# EAGLE design node_vibration (EAGLE 6.6.0)
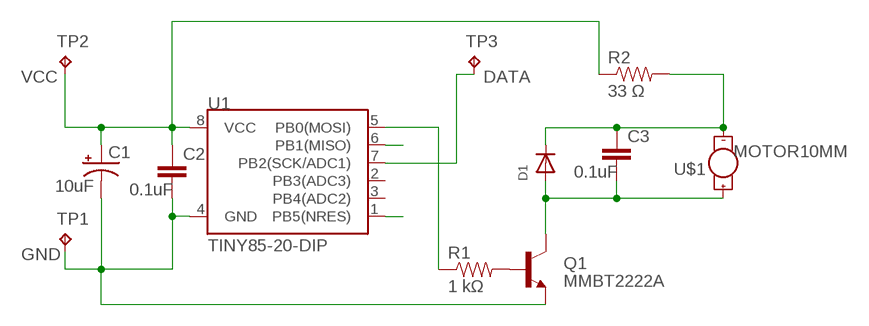
[diagram p0: schematic, sheet 1]

## Parts
C1  10uF  10UF-16V-10%(TANT)  [EIA3216]
C2  0.1uF  CAP1206  [1206]
C3  0.1uF  CAP1206  [1206]
D1  DIODESMA  [SMADIODE]
Q1  MMBT2222A  TRANSISTOR_NPNMMBT2222A  [SOT23-3]
R1  1 kΩ  RESISTOR1206  [1206]
R2  33 Ω  RESISTOR1206  [1206]
TP1  PADSTP13R  [CIRCLE-PAD-1/4]
TP2  PADSTP13R  [CIRCLE-PAD-1/4]
TP3  PADSTP13R  [CIRCLE-PAD-1/4]
U1  TINY85-20-DIP  ATTINY45TINY45-20-DIP  [DIP08]
U$1  MOTOR10MM  [VIBE-MOTOR-10MM]

## Nets
GND: C1.C(-) C2.2 Q1.2(E) TP1.TP U1.4(GND)
MISO-6: U1.6(PB1(MISO))
MOSI-5: R1.1 U1.5(PB0(MOSI))
N$1: Q1.1(B) R1.2
N$2: C3.1 D1.C R2.2 U$1.-
N$3: C3.2 D1.A Q1.3(C) U$1.+
RST: U1.1(PB5(NRES))
SCK-7: TP3.TP U1.7(PB2(SCK/ADC1))
VCC: C1.A(+) C2.1 R2.1 TP2.TP U1.8(VCC)
Unconnected: U1.2(PB3(ADC3)) U1.3(PB4(ADC2))

## Library data of the parts
C1 = SparkFun-Capacitors:10UF-16V-10%(TANT): CAP-00811 1206/EIA-3216 Tantalum capacitor; PROD_ID: CAP-00811
C2 C3 = SparkFun-Capacitors:CAP: Capacitor Standard 0603 ceramic capacitor, and 0.1" leaded capacitor.
D1 = adafruit:DIODE: Diode SMADIODE - SMA Surface Mount Package 20V 1A Schottky Diode Digikey: 641-1014-6-ND DO-1N4148 - Through Hole Small Current Diode SOD-123 20V 1 A (.5mV Vf) Schottky Diode - Digikey: MBRX120TPMSCT-ND SOD-323 10V 570mA (.38mV Vf, 3ns) Schottky Diode - Digikey: ZLLS410CT-ND SOD-523 30V 30mA Schottky Diode (RB751S-40TE61) - Digikey: RB751S-40TE61CT-ND SOT23-R/W - SOT23 Package (R = Solder Paste/Reflow Ovens, W = Hand-Soldering) BAT54Film 40V 300mA - Digikey: 497-7162-1-ND
Q1 = SparkFun-DiscreteSemi:TRANSISTOR_NPN: Generic NPN BJT MMBT2222A - TRANS-08049 (SOT-23, 1A 40V) MPSA42 - TRANS-09116 (SOT-23, 500mA 300V) MMBT5088LT1G - TRANS-11160 (SOT-23, 50 mA 30V) BC547 - COM-08928 <http://www.sparkfun.com/products/8928> (TO-92 45V 100mA) (1.Collector 2.Base 3.Emitter) 2N3904 - COM-00521 <http://www.sparkfun.com/products/521> (TO-92 40V 200mA) (1.Emitter 2.Base 3.Collector) P2N2222A - COM-12852 <http://www.sparkfun.com/products/12852> (TO-92 40V 600mA) (1.Collector 2.Base 3.Emitter); PROD_ID: TRANS-08049
R1 R2 = SparkFun-Passives:RESISTOR: Resistor Basic schematic elements and footprints for 0603, 1206, and PTH resistors.
TP1 = swamy-library:PADS: Pads; TP_SIGNAL_NAME: GND
TP2 = swamy-library:PADS: Pads; TP_SIGNAL_NAME: VCC
TP3 = swamy-library:PADS: Pads; TP_SIGNAL_NAME: DATA
U1 = SparkFun-DigitalIC:ATTINY45: Atmel 8-pin 2/4/8kB flash uC; PROD_ID: IC-09439; VALUE: TINY45-20-DIP
U$1 = swamy-library:MOTOR: Vibration Motor- ROB-08449 Physical dimension and wire connections for this powerful vibration motor. Motor has a self adhesive backing.

## Board
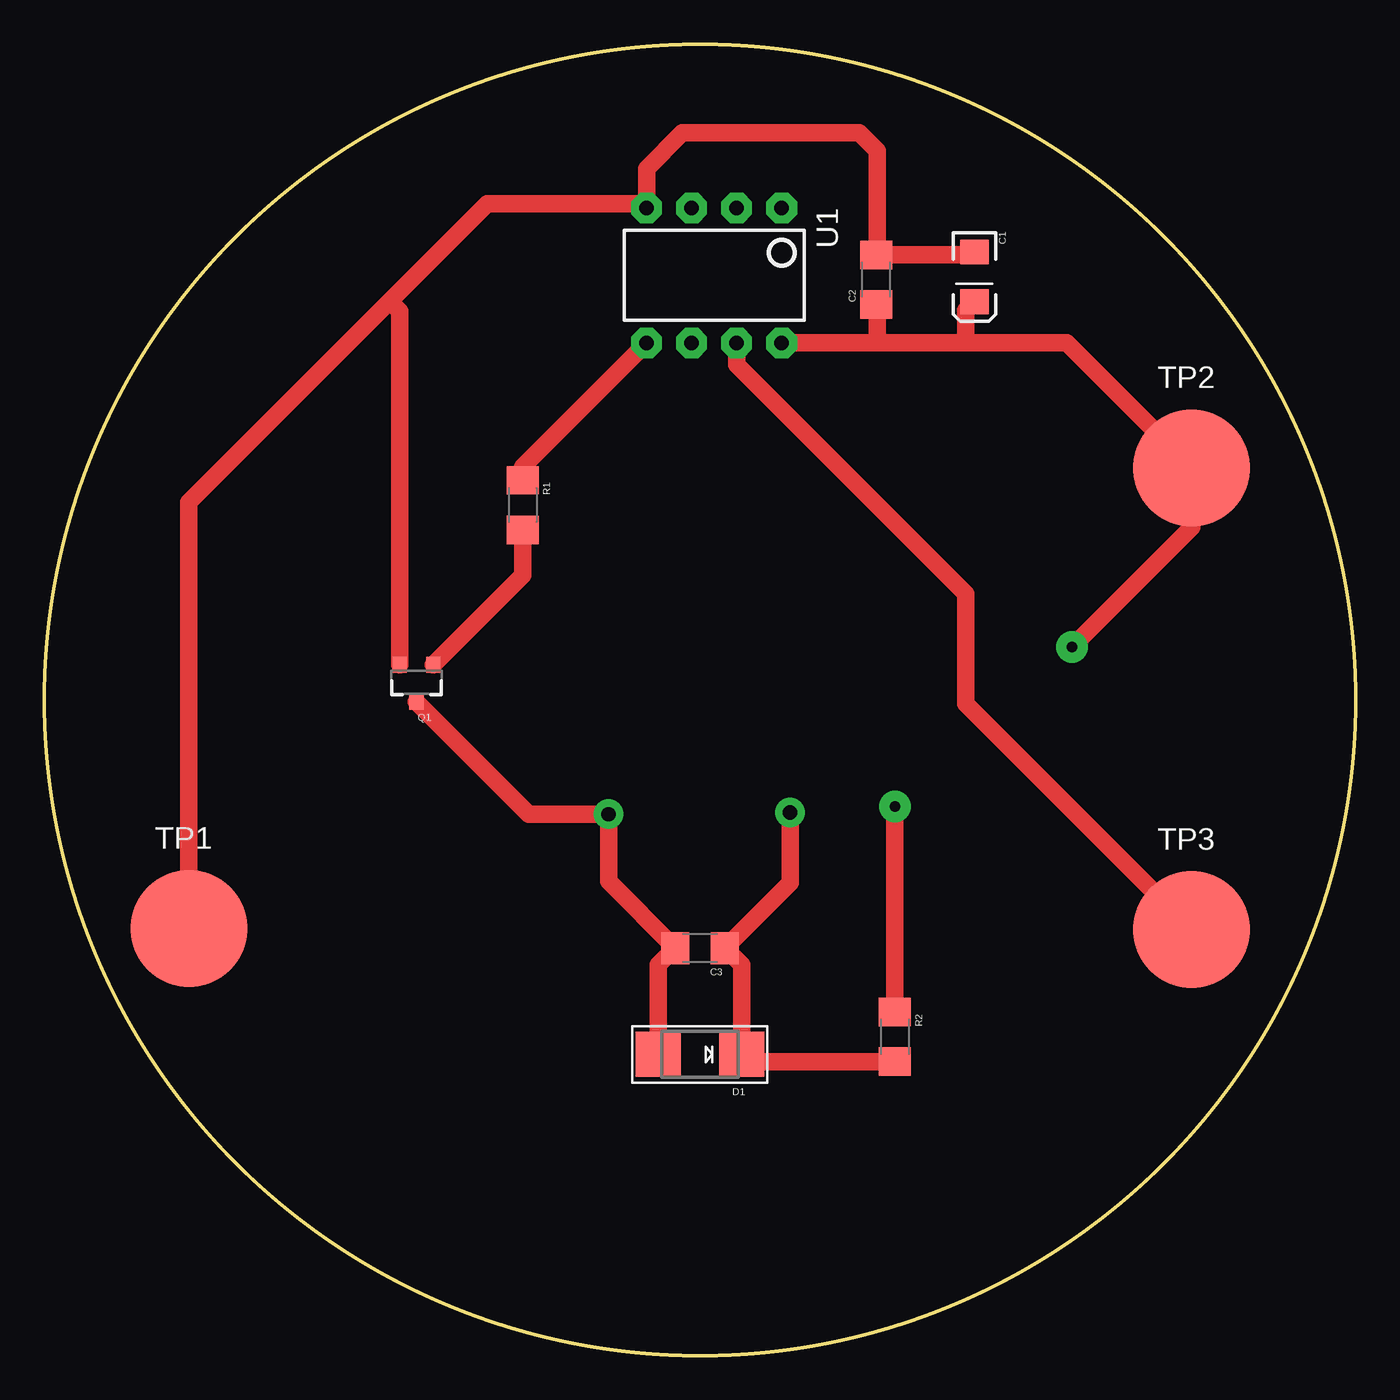
[diagram p1: board, top side]
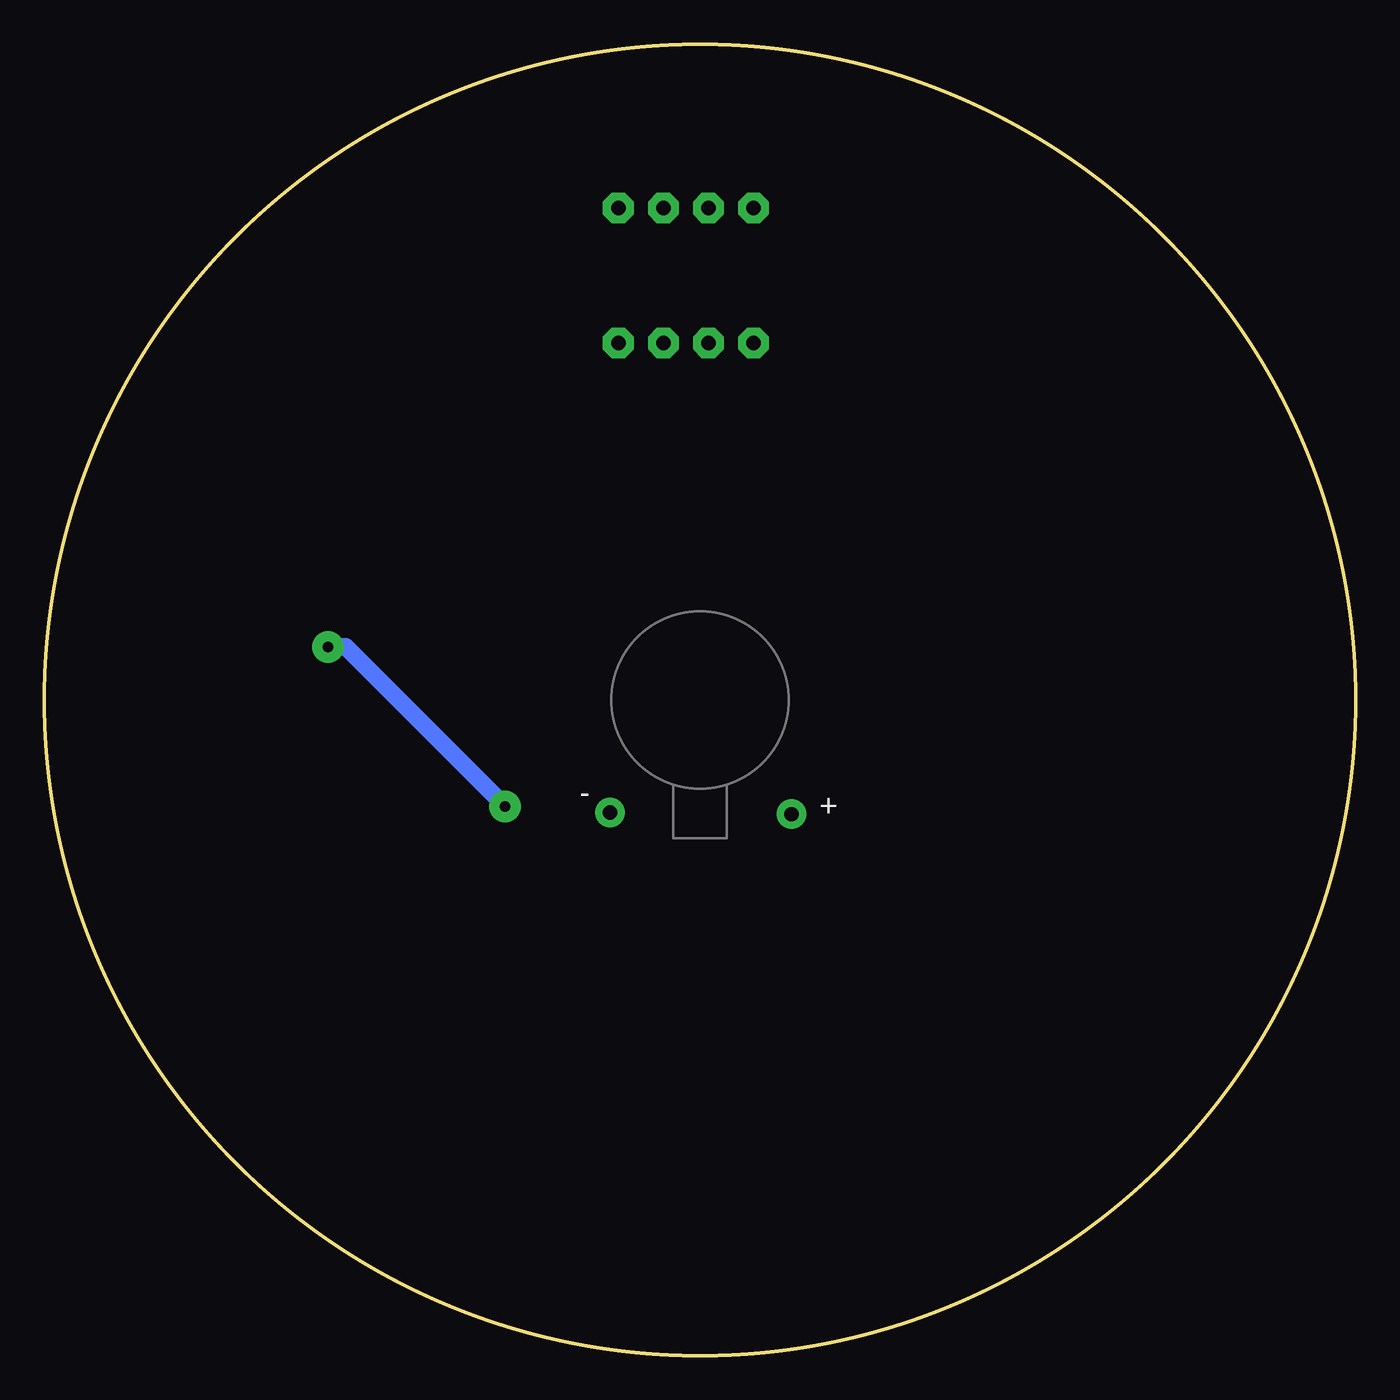
[diagram p2: board, bottom side, seen from below]

Size 74 x 74 mm. Coordinates in mm from the lower left corner, seen from the top.
Outline: circle at 37,37 radius 37
Copper layers (1*16): Top 0.035mm / dielectric 1.5mm / Bottom 0.035mm
Design rules "default": minimum track width 10mil, minimum drill 24mil, track to track 8mil, track to pad 8mil, pad to pad 8mil, via to via 8mil, smd to smd 8mil, copper to edge 40mil, drill to drill 8mil, minimum pad ring 10mil, minimum via ring 8mil, stop-mask expansion 4mil, vias tented up to drill 0mil, thermal gap 10mil

### Footprints (pad centres in the part's own frame; a part is rotated, then mirrored left to right if it is on the bottom)
EIA3216 = smd 1.4 x 1.6: A 1.4,0; C -1.4,0
1206 = smd 1.6 x 1.8: 1 -1.4,0; 2 1.4,0
SMADIODE = smd 2.54 x 2.54: A 2.349,0; C -2.349,0
SOT23-3 = smd 0.8 x 0.9: 1 -0.95,-1; 2 0.95,-1; 3 0,1.1
CIRCLE-PAD-1/4 = smd 6.604 x 6.604: TP 0,0
DIP08 = drill 0.813 pad 1.727 octagon: 1 -3.81,-3.81; 2 -1.27,-3.81; 3 1.27,-3.81; 4 3.81,-3.81; 5 3.81,3.81; 6 1.27,3.81; 7 -1.27,3.81; 8 -3.81,3.81
VIBE-MOTOR-10MM = drill 0.8 pad 1.676: + 5.16,-6.44; - -5.08,-6.35

### Placement (x,y rotation side)
C1  52.48,60.88 270 top
C2  46.94,60.72 90 top
C3  37,23 180 top
D1  37,17 180 top
Q1  21,38 180 top
R1  27,48 270 top
R2  48,18 270 top
TP1  8.16,24.1 0 top
TP2  64.74,50.1 0 top
TP3  64.74,24.04 0 top
U1  37.8,60.96 180 top
U$1  37,37 0 bottom

### Tracks (layer width: path | path; a pad name or v marks a point on that pad's centre or on a via)
GND
  Top 1: C1.C 52.32,62.12 C2.2 47,62.18 47,68 46,69 36,69 33.99,66.99 U1.4 33.76,65 25,65 19.5,59.5 | TP1.TP 8.16,48.16 19.5,59.5 | Q1.2 20.05,58.95 19.5,59.5
MOSI-5
  Top 1: R1.1 27,50.16 U1.5
N$1
  Top 1: R1.2 27,44.05 Q1.1
N$2
  Top 1: U$1.- 42.08,26.68 C3.1 39.35,22.05 D1.C 39.75,16.6 R2.2
N$3
  Top 1: Q1.3 27.34,30.56 U$1.+ 31.84,26.76 C3.2 34.65,22.05 D1.A
N$4  (via drill 0.6 pad 1.78)
  other vias: 48,31
N$6  (via drill 0.6 pad 1.78)
  other vias: 58,40
SCK-7
  Top 1: U1.7 39.07,55.93 52,43 52,36.78 TP3.TP
VCC  (via drill 0.6 pad 1.78)
  Top 1: 52,57.15 57.69,57.15 TP2.TP 64.74,46.74 v58,40 | 52,57.15 47,57.15 | 47,57.15 U1.8 | C2.1 47,59.26 47,57.15 | C1.A 52,59 52,57.15 | R2.1 v48,31
  Bottom 1: v48,31 57,40 v58,40

### Text on the board
tLabels: VCC | GND | DATA | Vibration Module